# EAGLE design openautopihatv1point2x (EAGLE 8.3.1)
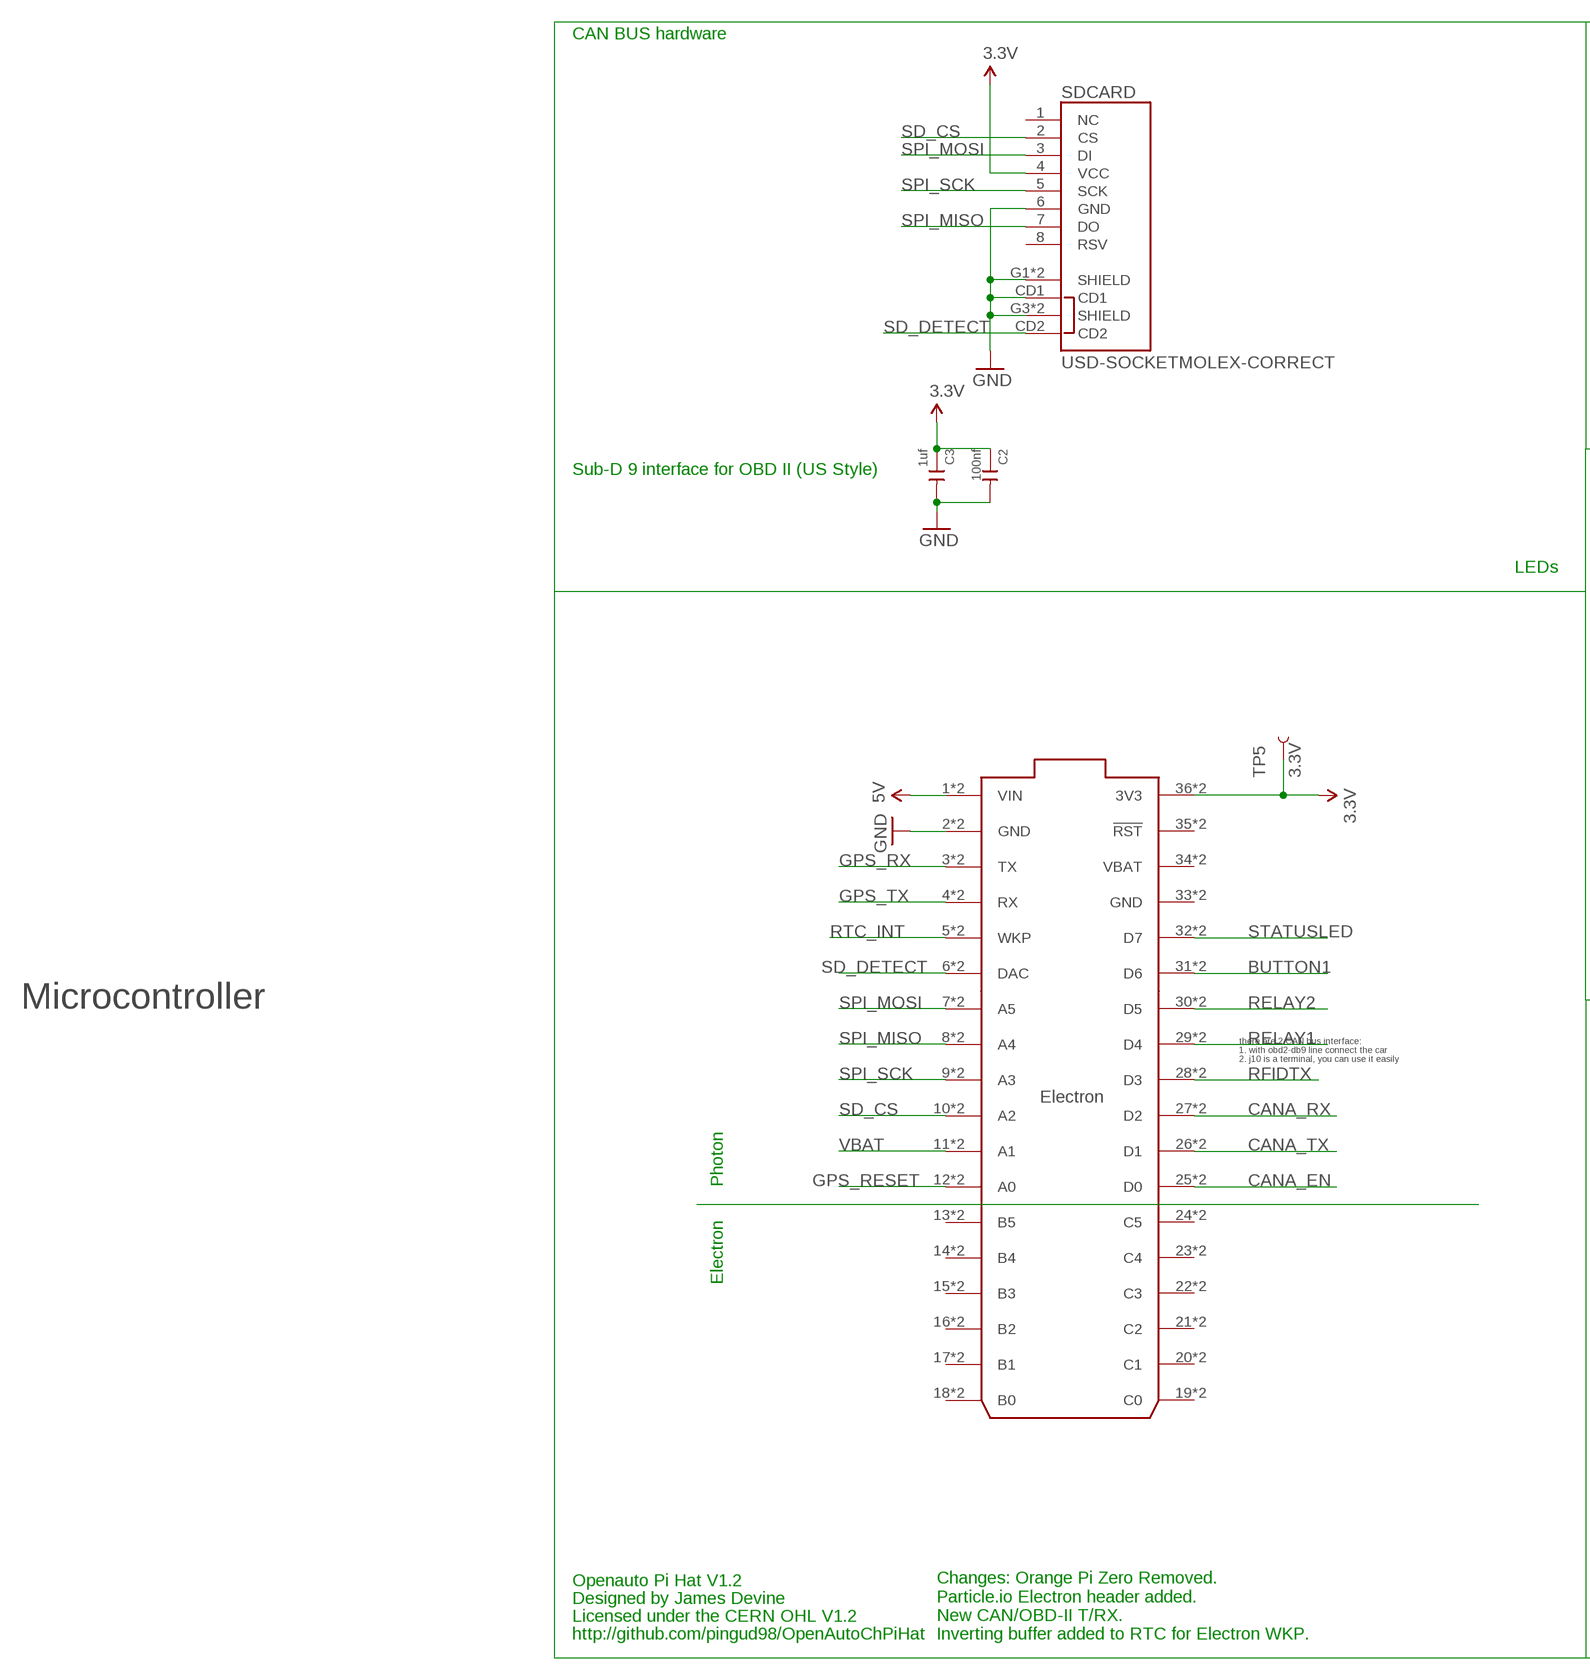
[diagram p0: schematic, sheet 1, part 1 of 2]
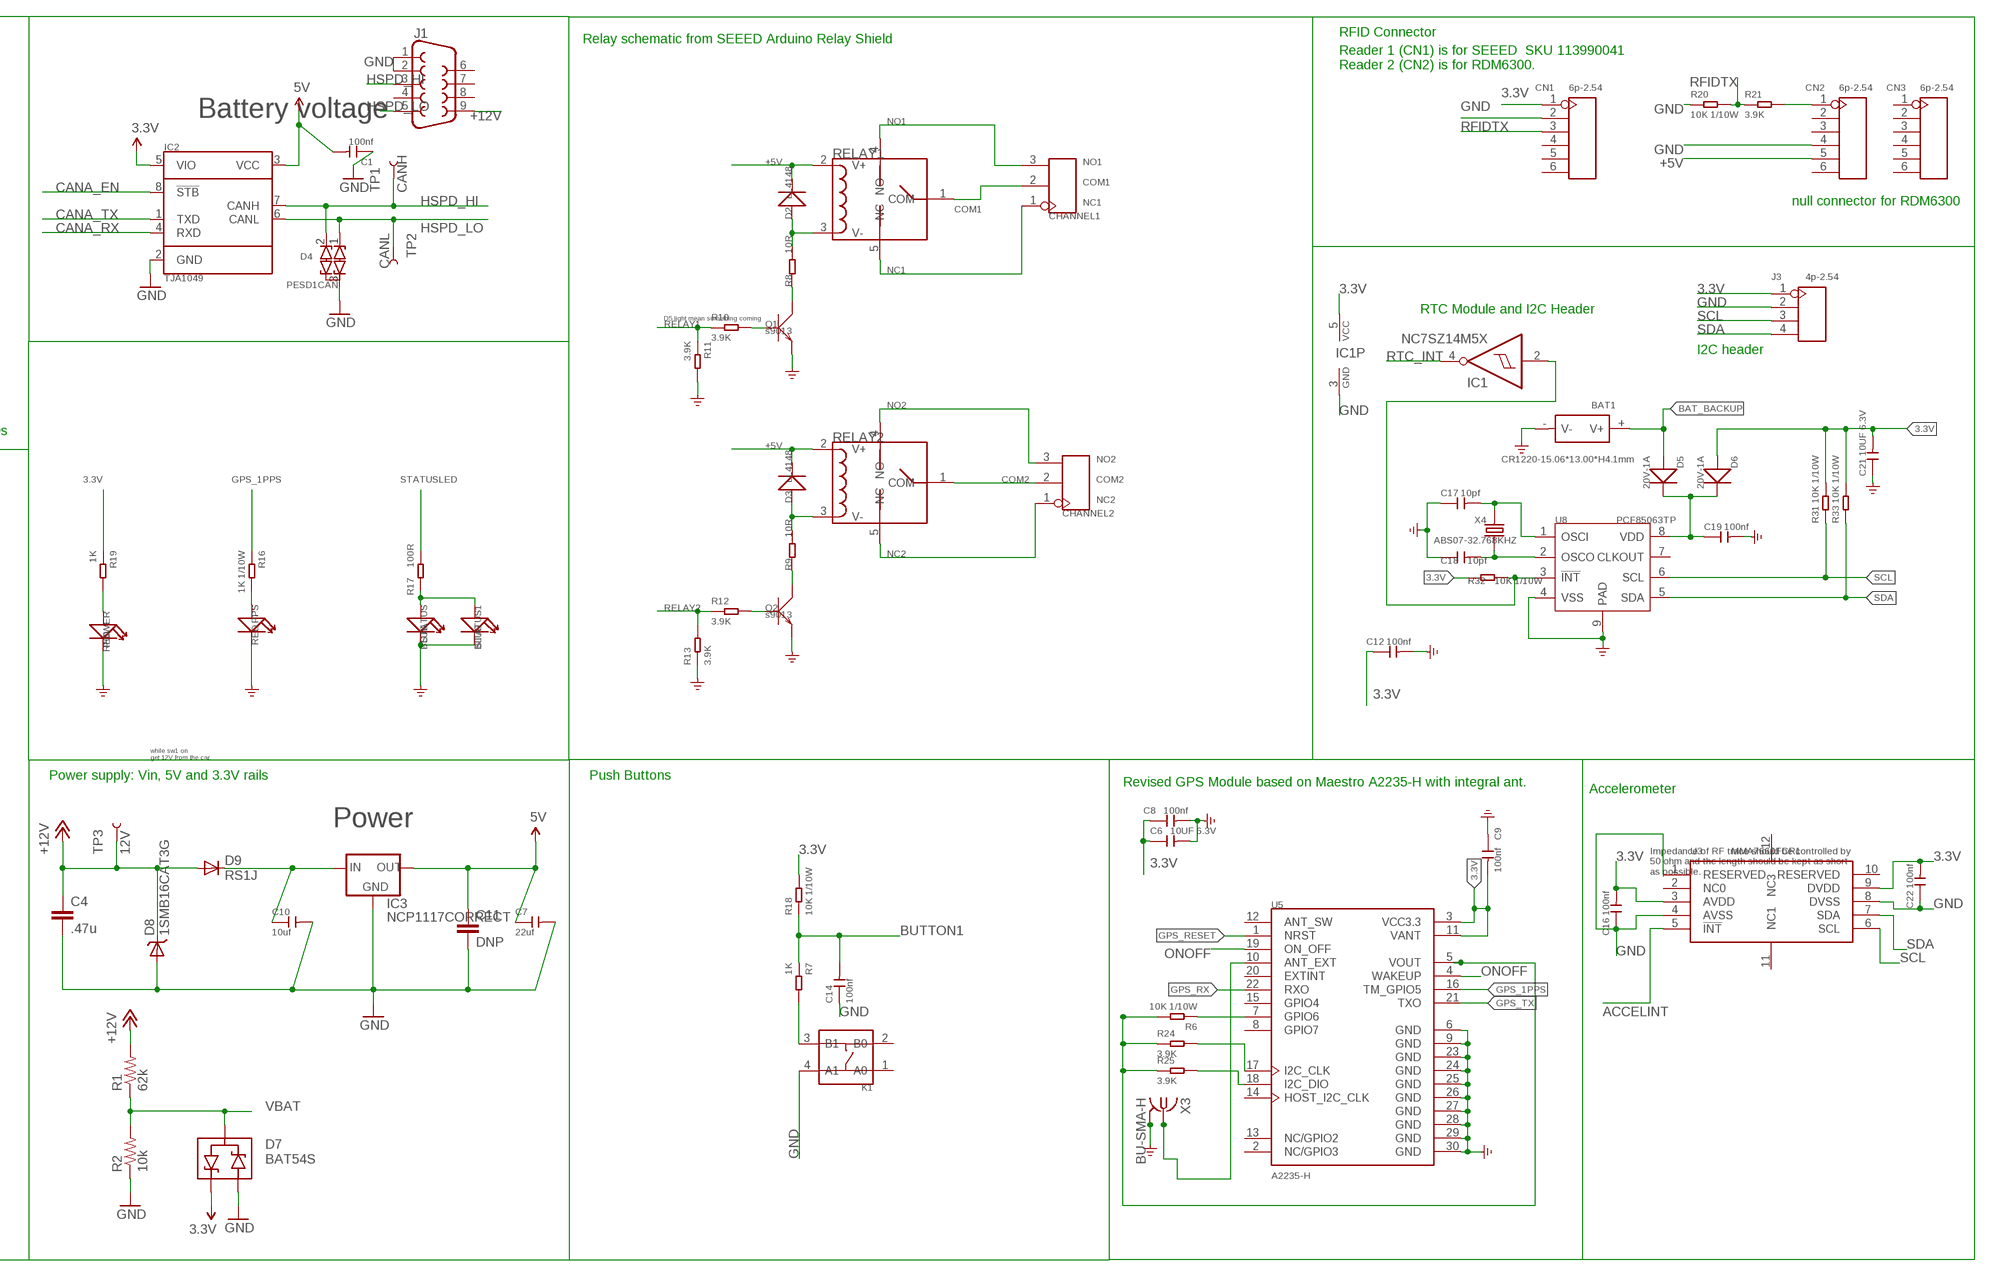
[diagram p1: schematic, sheet 1, part 2 of 2]

## Parts
BAT1  CR1220-15.06*13.00*H4.1mm  BAT-HOLDER'SMD-1220'  [BAT2P-SMD-16.4-CR1220]
C1  100nf  CERAMIC-100NF-50V-10%-X7R(0603)  [C0603]
C2  100nf  CERAMIC-100NF-50V-10%-X7R(0603)  [C0603]
C3  1uf  CERAMIC-1UF-25V-10%-X7R(0603)  [C0603]
C4  .47u  C-EUC0805  [C0805]
C6  10UF 6.3V  CERAMIC-10UF-6.3V-20%-X5R(0603)  [C0603]
C7  22uf  CERAMIC-22UF-6.3V-20%-X5R(0805)  [C0805]
C8  100nf  CERAMIC-100NF-50V-10%-X7R(0603)  [C0603]
C9  100nf  CERAMIC-100NF-50V-10%-X7R(0603)  [C0603]
C10  10uf  CERAMIC-10UF-25V-10%-X5R(0805)  [C0805]
C11  DNP  C-EUC0805  [C0805]
C12  100nf  CERAMIC-100NF-50V-10%-X7R(0603)  [C0603]
C14  100nf  CERAMIC-100NF-50V-10%-X7R(0603)  [C0603]
C16  100nf  CERAMIC-100NF-50V-10%-X7R(0603)  [C0603]
C17  10pf  CERAMIC-10PF-50V-5%-NPO(0603)  [C0603]
C18  10pf  CERAMIC-10PF-50V-5%-NPO(0603)  [C0603]
C19  100nf  CERAMIC-100NF-50V-10%-X7R(0603)  [C0603]
C21  10UF 6.3V  CERAMIC-10UF-6.3V-20%-X5R(0603)  [C0603]
C22  100nf  CERAMIC-100NF-50V-10%-X7R(0603)  [C0603]
CHANNEL1  SCREW-TERMINAL-3P'3.5'  [3P-3.5]
CHANNEL2  SCREW-TERMINAL-3P'3.5'  [3P-3.5]
CN1  6p-2.54  DIP-BLACK-FEMALE-HEADER-VERT(6P-2.54)  [H6-2.54]
CN2  6p-2.54  DIP-BLACK-FEMALE-HEADER-VERT(6P-2.54)  [H6-2.54]
CN3  6p-2.54  DIP-BLACK-FEMALE-HEADER-VERT(6P-2.54)  [H6-2.54]
D2  LL4148  D'1N4148-SMD'  [LL-34]
D3  LL4148  D'1N4148-SMD'  [LL-34]
D4  PESD1CAN  DIODE_ESD_DUAL-SOT-23  [SOT23]
D5  20V-1A  SMD-DIODE-SCHOTTKY-20V-1A(SOD-123)  [SOD-123]
D6  20V-1A  SMD-DIODE-SCHOTTKY-20V-1A(SOD-123)  [SOD-123]
D7  BAT54S  [SOT23]
D8  1SMB16CAT3G  DIODE-TVS-SMB  [SMB-DIODE]
D9  RS1J  DIODESMA  [SMA-DIODE]
ELECTRON  ELECTRON_WITH_EXTERNAL_HEADERS  [ELECTRON_EXTERNAL]
IC1  NC7SZ14M5X  [SOT23-5]
IC2  TJA1049  [SO8]
IC3  NCP1117CORRECT  [SOT223]
J1  DB9MALE  [DB9_MALE]
J3  4p-2.54  DIP-BLACK-FEMALE-HEADER-VERT(4P-2.54)  [H4-2.54]
K1  DIP-SWITCH-TACTILE-SPST-NO/TS-1109(4P-D6.0MM)'TS-1109'  [SW4-6.0X6.0X5.0MM]
POWER  RED  LED'0603'  [LED-0603]
PPS  RED  LED'0603'  [LED-0603]
Q1  s9013  TRANSISTOR-NPN-SOT23  [SOT23]
Q2  s9013  TRANSISTOR-NPN-SOT23  [SOT23]
R1  62k  R-US_R0805  [R0805]
R2  10k  R-US_R0805  [R0805]
R6  10K 1/10W  SMD-RES-10K-5%-1/10W(0603)  [R0603]
R7  1K  SMD-RES-1K-1%-1/10W(0603)  [R0603]
R8  10R  R-0603  [R0603]
R9  10R  R-0603  [R0603]
R10  3.9K  SMD-RES-3.9K-5%-1/10W(0603)  [R0603]
R11  3.9K  SMD-RES-3.9K-5%-1/10W(0603)  [R0603]
R12  3.9K  SMD-RES-3.9K-5%-1/10W(0603)  [R0603]
R13  3.9K  SMD-RES-3.9K-5%-1/10W(0603)  [R0603]
R16  1K 1/10W  SMD-RES-1K-5%-1/10W(0603)  [R0603]
R17  100R  SMD-RES-100R-5%-1/10W(0603)  [R0603]
R18  10K 1/10W  SMD-RES-10K-5%-1/10W(0603)  [R0603]
R19  1K  SMD-RES-1K-1%-1/10W(0603)  [R0603]
R20  10K 1/10W  SMD-RES-10K-5%-1/10W(0603)  [R0603]
R21  3.9K  SMD-RES-3.9K-5%-1/10W(0603)  [R0603]
R24  3.9K  SMD-RES-3.9K-5%-1/10W(0603)  [R0603]
R25  3.9K  SMD-RES-3.9K-5%-1/10W(0603)  [R0603]
R31  10K 1/10W  SMD-RES-10K-5%-1/10W(0603)  [R0603]
R32  10K 1/10W  SMD-RES-10K-5%-1/10W(0603)  [R0603]
R33  10K 1/10W  SMD-RES-10K-5%-1/10W(0603)  [R0603]
RELAY1  RELAY-HLS8L-DC5V-S-C  [5P-19.0X15.5X15.8H]
RELAY2  RELAY-HLS8L-DC5V-S-C  [5P-19.0X15.5X15.8H]
SDCARD  USD-SOCKETMOLEX-CORRECT  [MICRO-SD-MOLEX-CORRECT]
STATUS  BLUE  LED'0603'  [LED-0603]
STATUS1  BLUE  LED'0603'  [LED-0603]
TP1  CANH  TEST-POINT3  [PAD.03X.03]
TP2  CANL  TEST-POINT3  [PAD.03X.03]
TP3  12V  TEST-POINT3  [PAD.03X.03]
TP5  3.3V  TEST-POINT3  [PAD.03X.03]
U3  MMA7660FCR1  MOTION/POSITION-MMA7660FCR1(DFN10)  [DFN10-0.5-3.0X3.0MM]
U5  A2235-H  [XCVR_A2235-H]
U8  PCF85063TP  RTC-PCF85063TP  [HWSON8-0.5-2X3X0.75MM]
X3  BU-SMA-H  [BU-SMA-H]
X4  ABS07-32.768KHZ  CRYSTAL-2P-3215  [X2-SMD-3.2X1.5X0.55MM]

## Nets
3.3V: C2.1 C3.1 C6.1 C8.1 C9.2 C12.1 C16.2 C21.2 C22.2 CN1.1 D6.+ D7.2(C1) ELECTRON.36(3V3) ELECTRON.@36(3V3) IC1.5(VCC) IC2.5(VIO) J3.1 R18.2 R19.1 R31.2 R32.1 R33.2 SDCARD.4(VCC) TP5.P$1 U3.3(AVDD) U3.9(DVDD) U5.3(VCC3.3) U5.11(VANT)
5V [power]: C1.2 C7.1 C11.1 ELECTRON.1(VIN) ELECTRON.@1(VIN) IC2.3(VCC) IC3.2(OUT) IC3.4(OUT)
!RTC_INT: IC1.2(I) R32.2 U8.3(!INT)
+5V [5V Line]: CN2.5 D2.C(-) D3.C(-) RELAY1.2(V+) RELAY2.2(V+)
+12V [power]: C4.1 D8.C D9.A J1.9 R1.2 TP3.P$1
ACCELINT: U3.5(!INT)
BAT_BACKUP: BAT1.+(V+) D5.+
BUTTON1: C14.2 ELECTRON.31(D6) ELECTRON.@31(D6) R7.1 R18.1
CANA_EN: ELECTRON.25(D0) ELECTRON.@25(D0) IC2.8(!STB)
CANA_RX: ELECTRON.27(D2) ELECTRON.@27(D2) IC2.4(RXD)
CANA_TX: ELECTRON.26(D1) ELECTRON.@26(D1) IC2.1(TXD)
COM1: CHANNEL1.2 RELAY1.1(COM)
COM2: CHANNEL2.2 RELAY2.1(COM)
GND [power]: BAT1.-(V-) C1.1 C2.2 C3.2 C4.2 C6.2 C7.2 C8.2 C9.1 C10.2 C11.2 C12.2 C14.1 C16.1 C17.1 C18.1 C19.2 C21.1 C22.1 CN1.2 CN2.4 D4.3(COM) D7.1(A2) D8.A ELECTRON.2(GND) ELECTRON.@2(GND) IC1.3(GND) IC2.2(GND) IC3.1(GND) J1.1 J1.2 J3.2 K1.4(A1) POWER.- PPS.- Q1.2(E) Q2.2(E) R2.1 R11.2 R13.1 R20.1 SDCARD.6(GND) SDCARD.CD1 SDCARD.G1(SHIELD) SDCARD.G2(SHIELD) SDCARD.G3(SHIELD) SDCARD.G4(SHIELD) STATUS1.- STATUS.- U3.1(RESERVED) U3.4(AVSS) U3.8(DVSS) U5.6(GND) U5.9(GND) U5.23(GND) U5.24(GND) U5.25(GND) U5.26(GND) U5.27(GND) U5.28(GND) U5.29(GND) U5.30(GND) U8.4(VSS) U8.9(PAD) X3.2 X3.3 X3.4 X3.5 ; supply symbol labelled GND_POWER
GPS_1PPS: R16.1 U5.16(TM_GPIO5)
GPS_RESET: ELECTRON.12(A0) ELECTRON.@12(A0) U5.1(NRST)
GPS_RX: ELECTRON.3(TX) ELECTRON.@3(TX) U5.22(RXO)
GPS_TX: ELECTRON.4(RX) ELECTRON.@4(RX) U5.21(TXO)
HSPD_HI: D4.2(C2) IC2.7(CANH) J1.3 TP1.P$1
HSPD_LO: D4.1(C1) IC2.6(CANL) J1.5 TP2.P$1
N$1: K1.3(B1) R7.2
N$4 [5V Line]: Q2.1(B) R12.2
N$5 [5V Line]: D3.A(+) R9.2 RELAY2.3(V-)
N$6 [5V Line]: Q1.3(C) R8.1
N$7 [5V Line]: D2.A(+) R8.2 RELAY1.3(V-)
N$8 [5V Line]: Q2.3(C) R9.1
N$9: PPS.+ R16.2
N$10: R17.2 STATUS1.+ STATUS.+
N$19: U5.10(ANT_EXT) X3.1
N$21: R6.2 R24.1 R25.1 U5.5(VOUT)
N$22: R6.1 U5.7(GPIO6)
N$23 [5V Line]: Q1.1(B) R10.2
N$24: CN2.1 R21.2
N$26: R24.2 U5.17(I2C_CLK)
N$27: R25.2 U5.18(I2C_DIO)
N$29: POWER.+ R19.2
N$40: C18.2 U8.2(OSCO) X4.1
N$41: C17.2 U8.1(OSCI) X4.2
N$43 [power]: C10.1 D9.C IC3.3(IN)
N$49: C19.1 D5.- D6.- U8.8(VDD)
NC1: CHANNEL1.1 RELAY1.5(NC)
NC2: CHANNEL2.1 RELAY2.5(NC)
NO1: CHANNEL1.3 RELAY1.4(NO)
NO2: CHANNEL2.3 RELAY2.4(NO)
ONOFF: U5.4(WAKEUP) U5.19(ON_OFF)
RELAY1 [5V Line]: ELECTRON.29(D4) ELECTRON.@29(D4) R10.1 R11.1
RELAY2: ELECTRON.30(D5) ELECTRON.@30(D5) R12.1 R13.2
RFIDTX: CN1.3 ELECTRON.28(D3) ELECTRON.@28(D3) R20.2 R21.1
RTC_INT: ELECTRON.5(WKP) ELECTRON.@5(WKP) IC1.4(O)
SCL: J3.3 R31.1 U3.6(SCL) U8.6(SCL)
SD_CS: ELECTRON.10(A2) ELECTRON.@10(A2) SDCARD.2(CS)
SD_DETECT: ELECTRON.6(DAC) ELECTRON.@6(DAC) SDCARD.CD2
SDA: J3.4 R33.1 U3.7(SDA) U8.5(SDA)
SPI_MISO: ELECTRON.8(A4) ELECTRON.@8(A4) SDCARD.7(DO)
SPI_MOSI: ELECTRON.7(A5) ELECTRON.@7(A5) SDCARD.3(DI)
SPI_SCK: ELECTRON.9(A3) ELECTRON.@9(A3) SDCARD.5(SCK)
STATUSLED: ELECTRON.32(D7) ELECTRON.@32(D7) R17.1
VBAT: D7.3(COM) ELECTRON.11(A1) ELECTRON.@11(A1) R1.1 R2.2
Unconnected: CN1.4 CN1.5 CN1.6 CN2.2 CN2.3 CN2.6 CN3.1 CN3.2 CN3.3 CN3.4 CN3.5 CN3.6 ELECTRON.13(B5) ELECTRON.14(B4) ELECTRON.15(B3) ELECTRON.16(B2) ELECTRON.17(B1) ELECTRON.18(B0) ELECTRON.19(C0) ELECTRON.20(C1) ELECTRON.21(C2) ELECTRON.22(C3) ELECTRON.23(C4) ELECTRON.24(C5) ELECTRON.35(!RST) ELECTRON.@13(B5) ELECTRON.@14(B4) ELECTRON.@15(B3) ELECTRON.@16(B2) ELECTRON.@17(B1) ELECTRON.@18(B0) ELECTRON.@19(C0) ELECTRON.@20(C1) ELECTRON.@21(C2) ELECTRON.@22(C3) ELECTRON.@23(C4) ELECTRON.@24(C5) ELECTRON.@35(!RST) J1.4 J1.6 J1.7 J1.8 K1.1(A0) K1.2(B0) SDCARD.1(NC) SDCARD.8(RSV) U3.2(NC0) U3.10(RESERVED) U3.11(NC1) U3.12(NC3) U5.2(NC/GPIO3) U5.8(GPIO7) U5.12(ANT_SW) U5.13(NC/GPIO2) U5.14(HOST_I2C_CLK) U5.15(GPIO4) U5.20(EXTINT) U8.7(CLKOUT)

## Notes on the sheet
- CAN BUS hardware
- RFID Connector
- Relay schematic from SEEED Arduino Relay Shield
- Reader 1 (CN1) is for SEEED  SKU 113990041
  Reader 2 (CN2) is for RDM6300.
- Battery voltage
- null connector for RDM6300
- RTC Module and I2C Header
- D5 light mean something coming
- I2C header
- Sub-D 9 interface for OBD II (US Style)
- LEDs
- while sw1 on
- get 12V from the car,
- Microcontroller
- Power supply: Vin, 5V and 3.3V rails | Push Buttons
- Revised GPS Module based on Maestro A2235-H with integral ant.
- there are 2 CAN bus interface: | Accelerometer
- 1. with obd2-db9 line connect the car
- 2. j10 is a terminal, you can use it easily
- Power
- Impedance of RF trace should be controlled by 
  50 ohm and the length should be kept as short 
  as possible.
- Photon
- Electron
- short route
- Openauto Pi Hat V1.2
- Designed by James Devine
- Licensed under the CERN OHL V1.2
- http://github.com/pingud98/OpenAutoChPiHat
- Changes: Orange Pi Zero Removed.
  Particle.io Electron header added.
  New CAN/OBD-II T/RX.
  Inverting buffer added to RTC for Electron WKP.

## Power pins joined to a net without a drawn wire
GND: ELECTRON.33(GND) ELECTRON.@33(GND)
VBAT: ELECTRON.34(VBAT) ELECTRON.@34(VBAT)

## Library data of the parts
BAT1 = Connector-new:BAT-HOLDER: BAT2P-13.5-CR1220:320170002;BAT2P-SMD-20.5-CR1632:320170007;METAL-CR2032-D20.0*H6.3MM:320170003;METAL-CR2032-SMD:320170006;PLASTIC-CR1220-L15.06*W13.0*H4.1MM:320170000;PLASTIC-CR2032-L25.2*W15.6*H5.2MM:320170005;BAT2P-11.55-D12.55-CR1220:313010022
C1 C2 = Seeed-Capacitor:CERAMIC-100NF-50V-10%-X7R(0603): 302010138; MPN: CC0603KRX7R9BB104; PARTNO: 08055C104KAT2A
C3 = Seeed-Capacitor:CERAMIC-1UF-25V-10%-X7R(0603): 302010139; MPN: CC0603KRX7R8BB105; PARTNO: CC0805KKX7R7BB105
C4 = rcl:C-EU: CAPACITOR, European symbol; PARTNO: C0805C474K5RACTU
C6 C21 = Seeed-Capacitor:CERAMIC-10UF-6.3V-20%-X5R(0603): 302010286; MPN: CC0603MRX5R5BB106
C7 = Seeed-Capacitor:CERAMIC-22UF-6.3V-20%-X5R(0805): 302010171; MPN: CC0805MKX5R5BB226; PARTNO: GRM219R61A226MEA0D
C8 C9 C12 C14 C16 C19 C22 = Seeed-Capacitor:CERAMIC-100NF-50V-10%-X7R(0603): 302010138; MPN: CC0603KRX7R9BB104
C10 = Seeed-Capacitor:CERAMIC-10UF-25V-10%-X5R(0805): 302010178; MPN: CC0805KKX5R8BB106; PARTNO: GRM21BR6YA106KE43L
C11 = rcl:C-EU: CAPACITOR, European symbol; PARTNO: GRM219R61A226MEA0D
C17 C18 = Seeed-Capacitor:CERAMIC-10PF-50V-5%-NPO(0603): 302010097; MPN: CC0603JRNPO9BN100
CHANNEL1 CHANNEL2 = Connector :SCREW-TERMINAL-3P
CN1-CN3 = Seeed-Connector:DIP-BLACK-FEMALE-HEADER-VERT(6P-2.54): 320030060; MPN: F185-1106A1BSYC1
D2 D3 = discrete:D*
D4 = MuniRent:DIODE_ESD_DUAL: Dual ESD Diode, with a common anode; PARTNO: PESD1CAN-215
D5 D6 = Seeed-Diode:SMD-DIODE-SCHOTTKY-20V-1A(SOD-123): 304020034; MPN: B5819W
D7 = MuniRent:BAT54S; PARTNO: BAT54S-7-F
D8 = BUG:DIODE-TVS; PARTNO: 1SMB16CAT3G; ROLE: Overvoltage protection
D9 = BUG:DIODE: Diode These are standard reverse protection diodes and small signal diodes. SMA package can handle up to about 1A. SOD-323 can handle about 200mA. What the SOD-323 package when ordering, there are some mfgs out there that are 5-pin packages.; PARTNO: RS1J-E3/5AT; ROLE: Reverse protection
ELECTRON = MuniRent:ELECTRON; PARTNO: PPTC181LFBN-RC
IC1 = 74xx-little-us:NC7SZ14: TinyLogic(R) UHS Inverter with Schmitt Trigger Input Source: http://www.fairchildsemi.com/ds/NC/NC7SZ14.pdf
IC2 = MuniRent:TJA1049; PARTNO: TJA1049T-118
IC3 = MuniRent:NCP1117; PARTNO: NCP1117LPST50T3G
J1 = SparkFun-Connectors:DB9: DB9 Connector Standard DB9 (D-Sub 9) serial connector. Can be used for CAN bus as well as RS485 and RS232. Footprint production proven. Here is the female version connector we sell at SparkFun: 9 Pin Female Serial Connector - PCB Mount <https://www.sparkfun.com/products/429> (PRT-00429) This connector has been used on the following SparkFun products: SparkFun RS232 Shifter - SMD <https://www.sparkfun.com/products/449> (PRT-00449) SparkFun RS232 Shifter SMD (No DB9) <https://www.sparkfun.com/products/8780> (PRT-08780); PROD_ID: CONN-09904
J3 = Seeed-Connector:DIP-BLACK-FEMALE-HEADER-VERT(4P-2.54): 320030017; MPN: F185-1104A1BSYA1
K1 = Seeed-Switch:DIP-SWITCH-TACTILE-SPST-NO/TS-1109(4P-D6.0MM): 311020024
POWER PPS STATUS STATUS1 = Discrete:LED*
Q1 Q2 = discrete:TRANSISTOR-NPN*: NPN audion
R1 = rcl:R-US_: RESISTOR, American symbol; PARTNO: ERJ-6ENF6202V
R2 = rcl:R-US_: RESISTOR, American symbol; PARTNO: ERJ-6ENF1002V
R6 R18 R20 R31-R33 = Seeed-Resistor:SMD-RES-10K-5%-1/10W(0603): 301010293; MPN: RC0603JR-0710KL
R7 R19 = Seeed-Resistor:SMD-RES-1K-1%-1/10W(0603): 301010298; MPN: RC0603FR-071KL
R8 R9 = discrete:R*
R10-R13 R21 R24 R25 = Seeed-Resistor:SMD-RES-3.9K-5%-1/10W(0603): 301010101; MPN: RC0603JR-073K9L
R16 = Seeed-Resistor:SMD-RES-1K-5%-1/10W(0603): 301010291; MPN: RC0603JR-071KL
R17 = Seeed-Resistor:SMD-RES-100R-5%-1/10W(0603): 301010090; MPN: RC0603JR-07100RL
RELAY1 RELAY2 = discrete:RELAY-HLS8L-DC5V-S-C
SDCARD = MuniRent:USD-SOCKET: microSD Socket Push-push type uSD socket. Schematic element and footprint production proven. Spark Fun Electronics SKU : PRT-00127. tDoc lines correctly indicate media card edge positions when inserting (unlocked, locked, depressed). NOTE: CD1 and CD2 are connected internally; PARTNO: 1040310811
TP1-TP3 TP5 = SparkFun-Passives:TEST-POINT: Bare copper test points for troubleshooting or ICT; BOM: EXCLUDE
U3 = Seeed-Sensor:MOTION/POSITION-MMA7660FCR1(DFN10): 314080009; MPN: MMA7660FCR1
U5 = A2235-H:A2235-H: Gps Module, Mini Outline w/ Ant; AVAILABILITY: Good; DESCRIPTION: Gps Module, Mini Outline w/ Ant; MF: Maestro Wireless; MP: A2235H; PACKAGE: None; PRICE: 15.93 USD
U8 = IC-new:RTC-PCF85063TP
X3 = con-coax:BU-SMA-H: FEMALE SMA CONNECTOR Radiall; OC_FARNELL: unknown; OC_NEWARK: unknown
X4 = Discrete-new:CRYSTAL-2P

## Net classes
0 default: width 0.152 mm, clearance 0.152 mm
1 power: width 0.152 mm, clearance 0.152 mm
2 5V Line: width 0.152 mm, drill 0.152 mm, clearance 0.152 mm

## Board
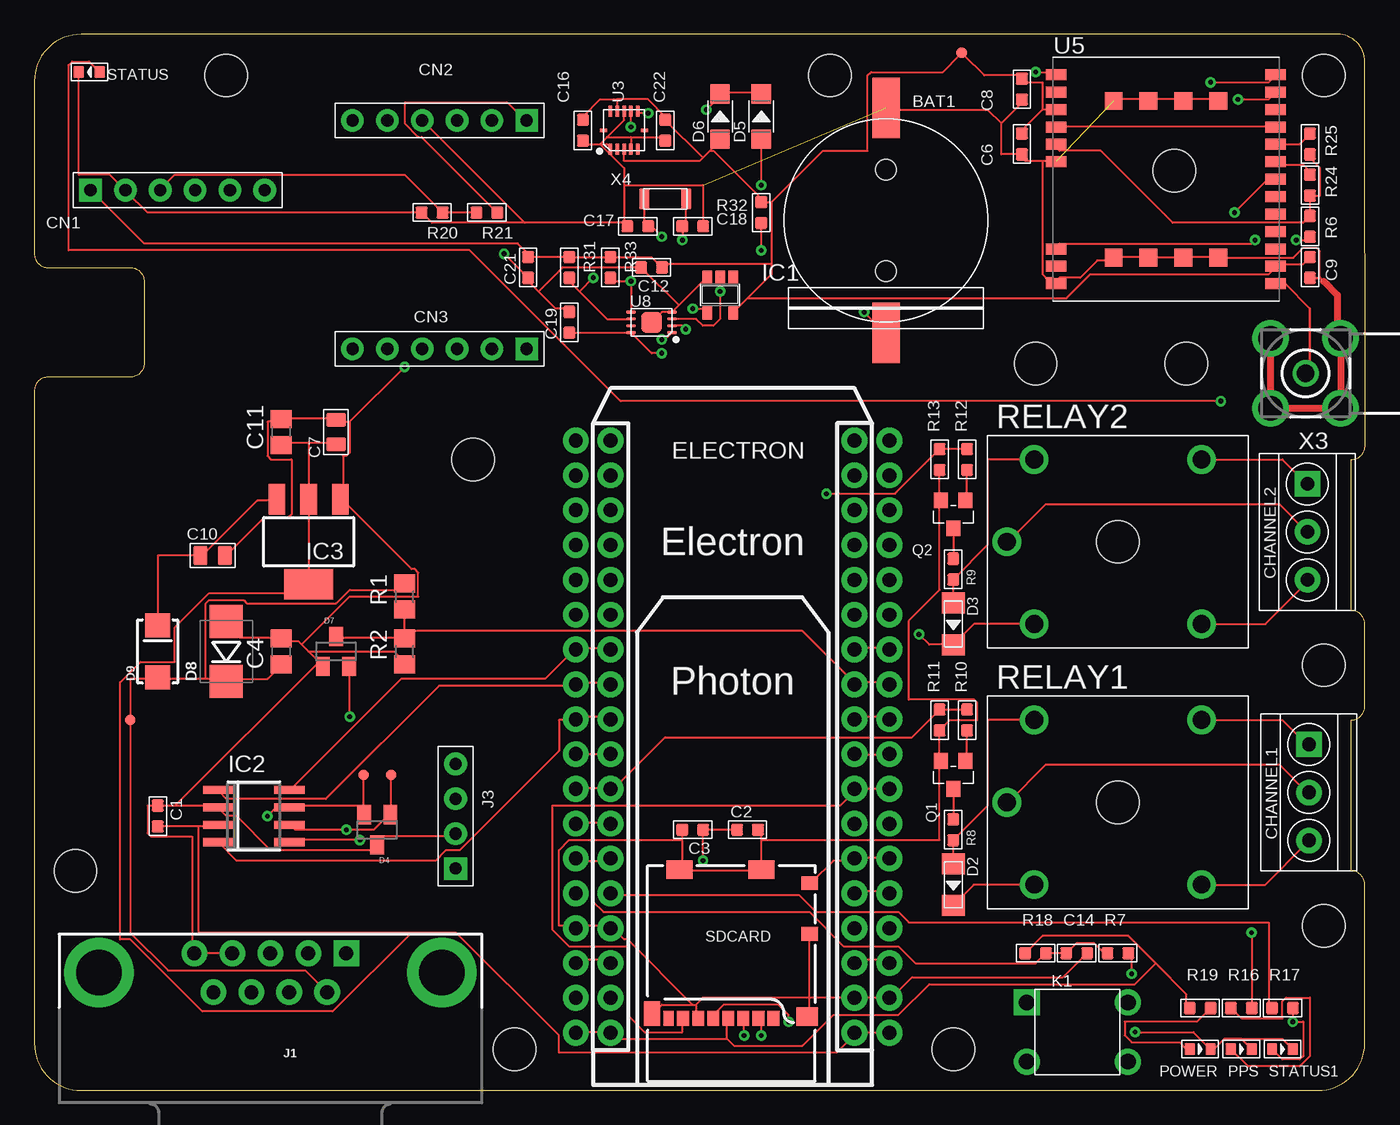
[diagram p2: board, top side]
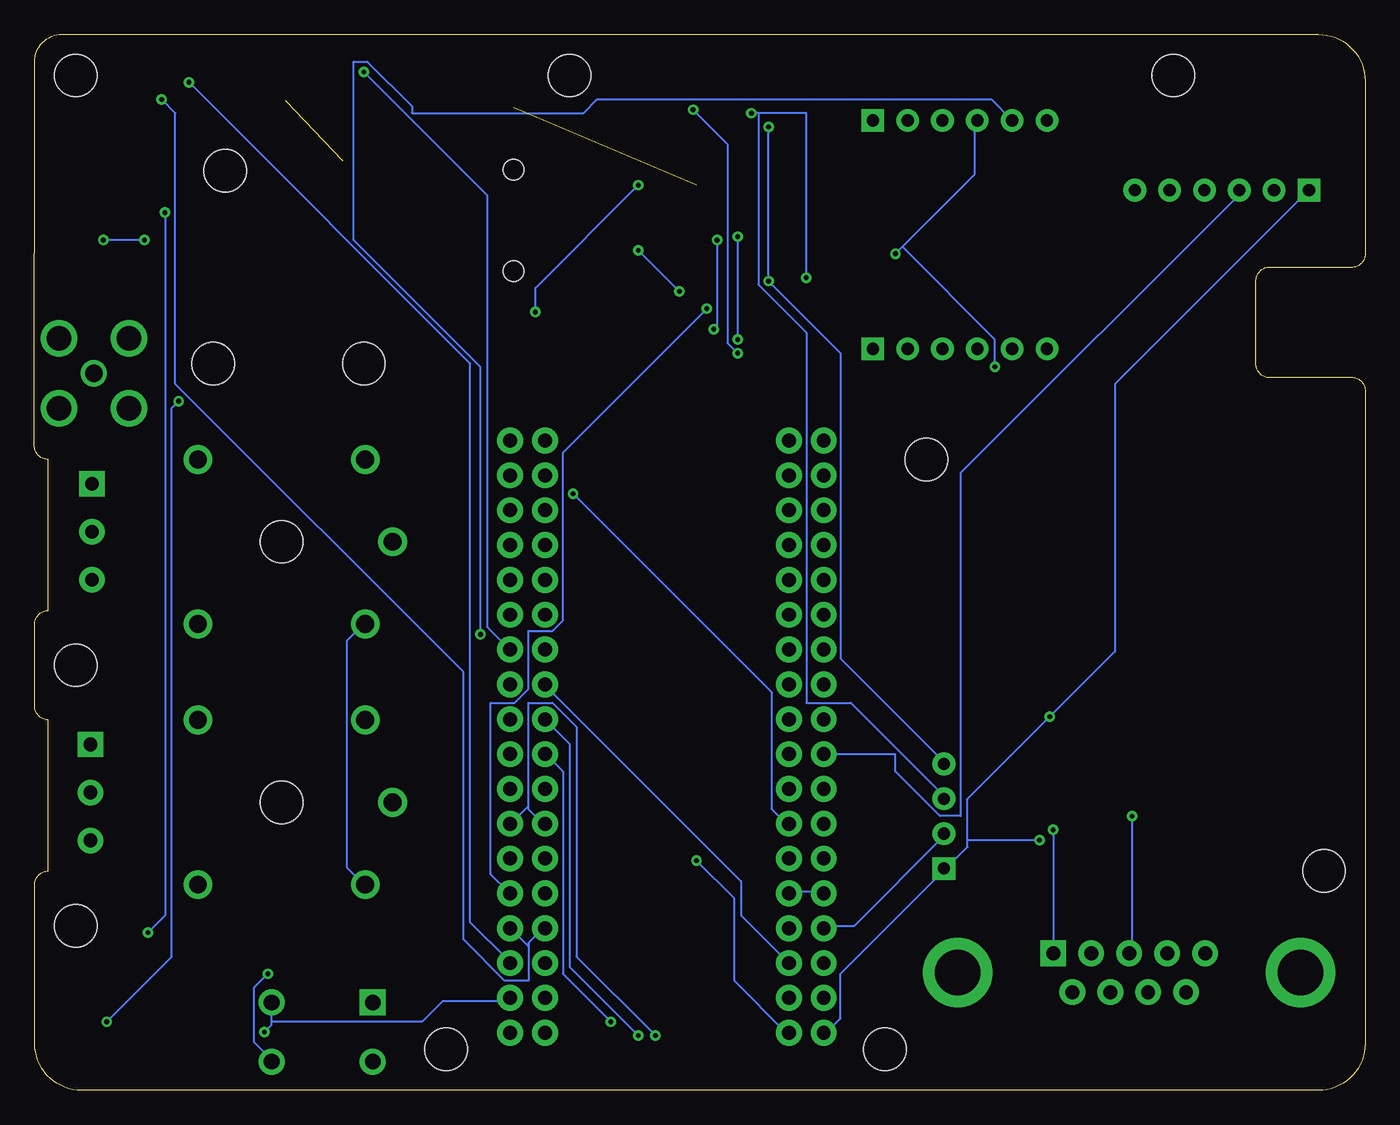
[diagram p3: board, bottom side, seen from below]

Size 97.03 x 77 mm. Coordinates in mm from the lower left corner, seen from the top.
Outline: 7,52 1,52 arc90 0,51 0,3.41 arc90 3.41,0 93.59,0 arc90 97,3.41 97,15 arc90 96,16 96,27 arc90 97,28 97,34 arc90 96,35 96,46 arc90 97.03,47.03 97,75 arc90 95,77 3.41,77 arc90 0,73.59 0,61 arc90 1,60 7,60 arc-90 8,59 8,53 arc-90 7,52
Copper layers (1*16): Top 0.035mm / dielectric 1.5mm / Bottom 0.035mm
Design rules "default": minimum track width 6mil, minimum drill 0.35mm, track to track 6mil, track to pad 6mil, pad to pad 6mil, via to via 6mil, smd to smd 6mil, copper to edge 40mil, drill to drill 6mil, minimum pad ring 10mil, minimum via ring 8mil, stop-mask expansion 4mil, vias tented up to drill 0mil, thermal gap 10mil
Holes 3.1 mm at 14,74 3,16 32,46 94,12 67,3 94,31 94,74 58,74 84,53 73,53 79,21 79,40 35,3
tKeepout: area 44,21 to 58,51
bKeepout: area 44,21 to 58,51

### Footprints (pad centres in the part's own frame; a part is rotated, then mirrored left to right if it is on the bottom)
BAT2P-SMD-16.4-CR1220 = smd 2 x 4.4: + 0,-8.2; - 0,8.2 | hole 1.5: 0,3.7; 0,-3.7
C0603 = smd 0.889 x 0.889: 1 0,0.762; 2 0,-0.762
C0805 = smd 1.3 x 1.5: 1 -0.95,0; 2 0.95,0
C0805' = smd 1.397 x 1.016: 1 0,0.889; 2 0,-0.889
3P-3.5 = drill 1 pad 1.85 square: 1 0,-3.5 | drill 1 pad 1.85: 2 0,0; 3 0,3.5
H6-2.54 = drill 0.889 pad 1.651 square: 1 0,6.35 | drill 0.889 pad 1.651: 2 0,3.81; 3 0,1.27; 4 0,-1.27; 5 0,-3.81; 6 0,-6.35
LL-34 = smd 1.524 x 1.676: A -1.524,0; C 1.524,0
SOT23 = smd 1 x 1.4: 1 -0.95,-1.1; 2 0.95,-1.1; 3 0,1.1
SOD-123 = smd 1.397 x 1.397: + -1.651,0; - 1.651,0
SMB-DIODE = smd 2.4 x 2.4: A 2.2,0; C -2.2,0
SMA-DIODE = smd 1.75 x 1.8: A -1.91,0; C 1.91,0
ELECTRON_EXTERNAL = drill 1.016 pad 1.88: 1 1.27,46.99; 2 1.27,44.45; 3 1.27,41.91; 4 1.27,39.37; 5 1.27,36.83; 6 1.27,34.29; 7 1.27,31.75; 8 1.27,29.21; 9 1.27,26.67; 10 1.27,24.13; 11 1.27,21.59; 12 1.27,19.05; 13 1.27,16.51; 14 1.27,13.97; 15 1.27,11.43; 16 1.27,8.89; 17 1.27,6.35; 18 1.27,3.81; 19 19.05,3.81; 20 19.05,6.35; 21 19.05,8.89; 22 19.05,11.43; 23 19.05,13.97; 24 19.05,16.51; 25 19.05,19.05; 26 19.05,21.59; 27 19.05,24.13; 28 19.05,26.67; 29 19.05,29.21; 30 19.05,31.75; 31 19.05,34.29; 32 19.05,36.83; 33 19.05,39.37; 34 19.05,41.91; 35 19.05,44.45; 36 19.05,46.99; @1 -1.27,46.99; @2 -1.27,44.45; @3 -1.27,41.91; @4 -1.27,39.37; @5 -1.27,36.83; @6 -1.27,34.29; @7 -1.27,31.75; @8 -1.27,29.21; @9 -1.27,26.67; @10 -1.27,24.13; @11 -1.27,21.59; @12 -1.27,19.05; @13 -1.27,16.51; @14 -1.27,13.97; @15 -1.27,11.43; @16 -1.27,8.89; @17 -1.27,6.35; @18 -1.27,3.81; @19 21.59,3.81; @20 21.59,6.35; @21 21.59,8.89; @22 21.59,11.43; @23 21.59,13.97; @24 21.59,16.51; @25 21.59,19.05; @26 21.59,21.59; @27 21.59,24.13; @28 21.59,26.67; @29 21.59,29.21; @30 21.59,31.75; @31 21.59,34.29; @32 21.59,36.83; @33 21.59,39.37; @34 21.59,41.91; @35 21.59,44.45; @36 21.59,46.99
SOT23-5 = smd 0.69 x 0.99: 1 -0.95,-1.29; 2 0,-1.29; 3 0.95,-1.29; 4 0.95,1.3; 5 -0.95,1.3
SO8 = smd 0.6 x 2.2: 1 -1.905,-2.6; 2 -0.635,-2.6; 3 0.635,-2.6; 4 1.905,-2.6; 5 1.905,2.6; 6 0.635,2.6; 7 -0.635,2.6; 8 -1.905,2.6
SOT223 = smd 1.219 x 2.235: 1 -2.311,-3.099; 2 0,-3.099; 3 2.311,-3.099 | smd 3.6 x 2.2: 4 0,3.099
DB9_MALE = drill 1.016 pad 1.88: 1 5.54,-1.42; 2 2.77,-1.42; 3 0,-1.42; 4 -2.77,-1.42; 6 4.15,1.42; 7 1.38,1.42; 8 -1.38,1.42; 9 -4.15,1.42 | drill 1.016 pad 1.88 square: 5 -5.54,-1.42 | drill 3.302 pad 5.08: G1 -12.5,0; G2 12.5,0
H4-2.54 = drill 0.889 pad 1.651 square: 1 0,3.81 | drill 0.889 pad 1.651: 2 0,1.27; 3 0,-1.27; 4 0,-3.81
SW4-6.0X6.0X5.0MM = drill 1.143 pad 1.905 square: 1 -3.683,2.159 | drill 1.143 pad 1.905: 2 -3.683,-2.159; 3 3.683,-2.159; 4 3.683,2.159
LED-0603 = smd 0.762 x 0.889: + -0.762,0; - 0.762,0
SOT23' = smd 1.016 x 1.143: 1 -0.889,-1.016; 2 0.889,-1.016; 3 0,1.016
R0805 = smd 1.3 x 1.5: 1 -0.95,0; 2 0.95,0
R0603 = smd 0.889 x 0.889: 1 0,0.762; 2 0,-0.762
R0603' = smd 0.889 x 0.889: 1 -0.762,0; 2 0.762,0
5P-19.0X15.5X15.8H = drill 1.3 pad 2.1: 1 -8.1,0; 2 -6.1,-6; 3 -6.1,6; 4 6.1,-6; 5 6.1,6
MICRO-SD-MOLEX-CORRECT = smd 0.85 x 1.1: 1 3.105,0.25; 2 2.005,0.25; 3 0.905,0.25; 4 -0.195,0.25; 5 -1.295,0.25; 6 -2.395,0.25; 7 -3.495,0.25 | smd 0.75 x 1.1: 8 -4.545,0.25 | smd 1.2 x 1: CD1 5.74,6.4; CD2 5.74,10.1 | smd 1.55 x 1.35: G1 5.565,0.375 | smd 1.17 x 1.8: G2 -5.755,0.6 | smd 1.9 x 1.35: G3 -3.735,11.075; G4 2.235,11.075
PAD.03X.03 = smd 0.762 x 0.762: P$1 0,0
DFN10-0.5-3.0X3.0MM = smd 0.8 x 0.25: 1 -1.375,1; 2 -1.375,0.5; 3 -1.375,0; 4 -1.375,-0.5; 5 -1.375,-1; 6 1.375,-1; 7 1.375,-0.5; 8 1.375,0; 9 1.375,0.5; 10 1.375,1 | smd 0.25 x 0.5: 11 0,-1.5; 12 0,1.5
XCVR_A2235-H = smd 1.5 x 0.8: 1 -8,7.62; 2 -8,6.35; 3 -8,5.08; 4 -8,3.81; 5 -8,2.54; 6 -8,1.27; 7 -8,-5.08; 8 -8,-6.35; 9 -8,-7.62; 10 8,-7.62; 11 8,-6.35; 12 8,-5.08; 13 8,-3.81; 14 8,-2.54; 15 8,-1.27; 16 8,0; 17 8,1.27; 18 8,2.54; 19 8,3.81; 20 8,5.08; 21 8,6.35; 22 8,7.62 | smd 1.3 x 1.3: 23 -3.81,5.715; 24 -1.27,5.715; 25 1.27,5.715; 26 3.81,5.715; 27 -3.81,-5.715; 28 -1.27,-5.715; 29 1.27,-5.715; 30 3.81,-5.715 | hole 3.1: 0.605,0.63
HWSON8-0.5-2X3X0.75MM = smd 0.25 x 0.7: 1 -0.75,-1.5; 2 -0.25,-1.5; 3 0.25,-1.5; 4 0.75,-1.5; 5 0.75,1.5; 6 0.25,1.5; 7 -0.25,1.5; 8 -0.75,1.5 | smd 1.5 x 1.5: 9 0,0
BU-SMA-H = drill 1.27: 1 0,0 | drill 1.778: 2 -2.55,2.55; 3 2.55,2.55; 4 2.55,-2.55; 5 -2.55,-2.55
X2-SMD-3.2X1.5X0.55MM = smd 0.762 x 1.524: 1 -1.524,0; 2 1.524,0

### Placement (x,y rotation side)
BAT1  62.1,63.43 0 top
C1  9,20 0 top
C2  52,19 90 top
C3  48,19 270 top
C4  18,32 90 top
C6  72,69 0 top
C7  22uf  [C0805']  22,48 180 top
C8  72,73 0 top
C9  93,60 180 top
C10  10uf  [C0805']  13,39 90 top
C11  18,48 90 top
C12  45,60 270 top
C14  76,10 270 top
C16  40,70 180 top
C17  44,63 90 top
C18  48,63 270 top
C19  39,56 180 top
C21  36,60 180 top
C22  46,70 180 top
CHANNEL1  92.93,21.72 180 top
CHANNEL2  92.82,40.72 180 top
CN1  10.45,65.63 90 top
CN2  29.55,70.72 270 top
CN3  29.55,54.07 270 top
D2  67,15 270 top
D3  67,34 270 top
D4  25,19 180 top
D5  53,71 90 top
D6  50,71 90 top
D7  22,32 0 top
D8  14,32 90 top
D9  9,32 90 top
ELECTRON  61.07,51.19 180 top
IC1  50,58 180 top
IC2  16,20 270 top
IC3  20,40 180 top
J1  17.21,8.58 180 top
J3  30.71,19.99 180 top
K1  76.04,4.25 0 top
POWER  85,3 0 top
PPS  88,3 0 top
Q1  s9013  [SOT23']  67,23 180 top
Q2  s9013  [SOT23']  67,42 180 top
R1  27,36 90 top
R2  27,32 90 top
R6  93,63 180 top
R7  79,10 90 top
R8  10R  [R0603']  67,19 270 top
R9  10R  [R0603']  67,38 270 top
R10  68,27 0 top
R11  66,27 0 top
R12  68,46 0 top
R13  66,46 180 top
R16  88,6 270 top
R17  91,6 90 top
R18  73,10 270 top
R19  85,6 90 top
R20  29,64 90 top
R21  33,64 90 top
R24  93,66 180 top
R25  93,69 180 top
R31  39,60 180 top
R32  53,64 0 top
R33  42,60 180 top
RELAY1  79,21 0 top
RELAY2  79,40 0 top
SDCARD  50.79,5.01 0 top
STATUS  4.01,74.24 180 top
STATUS1  91,3 0 top
TP1  24,23 0 top
TP2  26,23 0 top
TP3  7,27 0 top
TP5  67.61,75.65 0 top
U3  43,70 90 top
U5  82.5,66.43 0 top
U8  45,56 90 top
X3  92.69,52.28 0 top
X4  46,65 180 top

### Tracks (layer width: path | path; a pad name or v marks a point on that pad's centre or on a via)
3.3V  (via drill 0.35)
  Top 0.152: v23,27.25 23,30.75 D7.2 | v23.75,18.25 18.75,18.25 IC2.5 | 81.75,9.25 84,7 84,6 R19.1 | 81.75,9.25 79.75,11.25 73.5,11.25 R18.2 | C2.1 C3.1 v48.75,16.75 | 50.5,3.75 50.5,5.25 SDCARD.4 | 50.5,3.75 42.5,3.75 42.25,4 ELECTRON.36 42,4.25 39.5,4.25 ELECTRON.@36 | 81.75,9.25 80.25,7.75 65.25,7.75 63,5.5 58.25,5.5 56,3.25 51,3.25 50.5,3.75 | R31.2 C21.2 36,61 35.25,61.75 8,61.75 4.25,65.5 CN1.1 | R31.2 R33.2 | R31.2 | R33.2 45,60.75 C12.1 46,60 46.25,60.25 53.75,60.25 | R33.2 | 73.5,71.5 72,70 C6.1 | 73.5,71.5 U5.3 | 73.5,71.5 73.5,73.5 72.25,73.5 C8.1 72,74 69.25,74 67.75,75.5 TP5.P$1 67.5,75.5 66.25,74.25 61,74.25 60.75,74 60.75,68.5 57.5,68.5 53.75,64.75 | C9.2 92.5,60.25 90.5,60.25 U5.11 90.5,60 90,59.5 77,59.5 75.25,57.75 52,57.75 | 42.5,72.25 U3.9 | 42.5,72.25 41.25,72.25 40,71 C16.2 | U3.3 43,67.75 48.5,67.75 48.75,68 | 49.25,68.5 50,69.25 D6.+ | 49.25,68.5 48.75,68 | 49.25,68.5 49.5,68.5 53,65 R32.1 53.75,64.75 | 48.75,68 C22.2 46,71 44.75,72.25 42.5,72.25 | 52,57.75 53.75,59.5 53.75,60.25 | 52,57.75 IC1.5 | 53.75,64.75 53.75,60.25
  Bottom 0.152: 29,18.25 29,17.75 30.5,16.25 J3.1 30.75,16 38.25,8.5 38.25,5.25 39.25,4.25 ELECTRON.@36 | 29,18.25 29,21.25 v23,27.25 18.25,32 18.25,51.5 4.25,65.5 CN1.1 | 29,18.25 v23.75,18.25 | v48.75,16.75 46,14 46,8 42.25,4.25 ELECTRON.36
5V
  Top 0.152: 20,47.25 18,47.25 C11.1 | 20,47.25 22,47.25 C7.1 | 20,47.25 IC3.2 IC3.4 20,36.75 19.5,36.25 12.75,36.25 10.25,33.75 10.25,31.25 7.75,31.25 6.25,29.75 6.25,11 7,11 12.25,5.75 21.75,5.75 27.5,11.5 | 12,19.25 13.25,19.25 IC2.3 | 12,19.25 C1.2 | 12,19.25 12,11.5 27.5,11.5 | 27.5,11.5 30.75,11.5 38.25,4 38.25,2.75 58.5,2.75 59.75,4 ELECTRON.1 60,4.25 62.25,4.25 ELECTRON.@1
!RTC_INT  (via drill 0.35)
  Top 0.152: U8.3 48.25,56.25 48.75,55.75 49.5,55.75 50,56.25 v50,58.25 IC1.2 | v53,61.25 R32.2
  Bottom 0.152: v50,58.25 v53,61.25
+5V  (via drill 0.35)
  Top 0.152: RELAY1.2 68.5,15 67,13.5 D2.C | 67,32.5 68.5,34 RELAY2.2 | v64.5,33.25 65.25,32.5 67,32.5 | 67,32.5 D3.C
  Bottom 0.152: v64.5,33.25 64.5,52.75 73.75,62 73.75,75 72.75,75 69.5,71.75 69.5,71.25 57,71.25 56,72.25 27.25,72.25 25.75,70.75 CN2.5 | RELAY1.2 73,15 74.25,16.25 74.25,32.75 73,34 RELAY2.2
+12V
  Top 0.152: 9,30 7,30 TP3.P$1 7,11.5 9.75,8.75 19.75,8.75 21.25,7.25 J1.9 | 14,30 17,30 18,31 C4.1 | 12.5,30 12.5,35.5 12.75,35.75 15.25,35.75 15.5,35.5 22,35.5 23,36.5 26.75,36.5 27,36.75 R1.2 | 14,30 12.5,30 | 14,30 D8.C | 12.5,30 9,30 | 9,30 D9.A
BAT_BACKUP  (via drill 0.35)
  Top 0.152: v53,66 D5.+ | v60.5,56.75 62,55.25 BAT1.+
  Bottom 0.152: v53,66 60.5,58.5 v60.5,56.75
BUTTON1
  Top 0.152: R7.1 78,10 77.25,10.75 76,10.75 C14.2 R18.1 73,9.25 64.25,9.25 63,10.5 59,10.5 56.5,13 41.5,13 40.75,13.75 40.75,16.75 | 40.75,16.75 39.5,16.75 ELECTRON.@31 | 40.75,16.75 42,16.75 ELECTRON.31
CANA_EN
  Top 0.152: IC2.8 18.75,22 26.75,30 37.25,30 39.25,32 ELECTRON.@25 39.5,32.25 42,32.25 ELECTRON.25
CANA_RX
  Top 0.152: IC2.4 13.5,18 14.75,16.75 29.25,16.75 30,17.5 31,17.5 38.25,24.75 38.25,27 39.25,27 ELECTRON.@27 39.5,27.25 42,27.25 ELECTRON.27
CANA_TX
  Top 0.152: IC2.1 13.5,21.75 14,21.25 21.25,21.25 29.5,29.5 39.25,29.5 ELECTRON.@26 39.5,29.75 42,29.75 ELECTRON.26
COM1
  Top 0.152: CHANNEL1.2 92.75,21.75 90.75,23.75 73.75,23.75 71,21 RELAY1.1
COM2
  Top 0.152: CHANNEL2.2 92.75,40.75 90.75,42.75 73.75,42.75 71,40 RELAY2.1
GND  (via drill 0.35)  (2 unrouted)
  Top 0.152: 36.75,58.25 38,57 39,57 C19.2 | 36.75,58.25 36,59 C21.1 v34.25,61 | 47,57.25 49,59.25 IC1.3 | 47,57.25 U8.4 45.75,56.75 U8.9 | 47,57.25 C12.2 38.5,60 36.75,58.25 | STATUS.- 3.25,74 3.25,66.75 5.5,66.75 6.5,65.75 CN1.2 6.75,65.5 8.25,64 R20.1 29,63.25 35.75,63.25 | 41.25,69 40,69 C16.1 | 41.25,69 41.75,69 42,68.75 U3.1 | U3.8 43,70.75 41.75,69.5 | 41.25,69 41.75,69.5 | 43.5,69.5 U3.4 | 41.75,69.5 43.5,69.5 | 43,66 43,67.25 41.25,69 | 43,66 43,63.25 | 43,63.25 43,63 C17.1 43,63.25 | 43,66 48.75,66 C18.1 | 43,63.25 35.75,63.25 | 43.5,69.5 45.75,69.5 C22.1 | 35.75,63.25 CN2.4 | C10.2 14,39 16.75,41.75 18.5,41.75 18.75,42 18.75,46 17.25,46 17,46.25 17,48.75 18,48.75 C11.2 18,49 22,49 C7.2 22,48.75 23,48.75 | 23,48.75 23,46.5 22.75,46.25 22.5,46.25 22.5,43.25 IC3.1 22.5,43 27.5,38 27.75,38 28,37.75 28,36 23,36 19.5,32.5 | 19.5,32.5 19.25,32.75 18,32.75 C4.2 18,33 15,33 14,34 D8.A | 19.5,32.5 20,32 | 20,32 20.75,31.25 | 20.75,31.25 21,31 D7.1 20.75,31.25 | 20,32 26.25,32 27,31.25 R2.1 | J1.2 J1.1 11.5,10 11.5,18.5 8.5,18.5 8.25,18.75 8.25,20.75 C1.1 | 10.25,20.75 13.25,20.75 IC2.2 13.5,20.5 14,20 14.75,20 17.25,17.5 24.75,17.5 25,17.75 D4.3 25,18 25.5,18.5 30.5,18.5 J3.2 | 10.25,20.75 C1.1 | C1.1 | 10.25,20.75 20.75,31.25 | 23,48.75 v27,52.75 | 74.5,59 74.75,59.25 76.25,59.25 77.5,60.5 78.5,60.5 U5.27 78.75,60.75 81,60.75 U5.28 81.25,60.75 83.75,60.75 U5.29 84,60.75 86.25,60.75 U5.30 91.81,60.72 92.53,61.44 93.47,61.44 93.67,61.24 93.67,59.33 94,59 | 73.5,67.75 74.5,67.75 U5.6 | 73.5,67.75 72.25,67.75 72,68 C6.2 70.5,68.25 70.5,70.5 | 70.5,70.5 72,72 C8.2 | 70.5,70.5 69.5,71.5 62.25,71.5 BAT1.-
  Top 0.152: 74.5,59 74.25,59.25 73.75,59.25 73.5,59.5 73.5,67.75 | 74.5,59 U5.9 | U5.23 78.75,72.25 81,72.25 U5.24 81.25,72.25 83.75,72.25 U5.25 84,72.25 86.25,72.25 U5.26 | R13.1 66,43.25 Q2.2 66,43 66,36.5 63.75,34.25 63.75,28.5 68.5,28.5 68.75,28.25 68.75,27 66.75,27 R11.2 66,24.25 Q1.2 66,24 66,18.25 53,18.25 | 47.25,18.25 47.25,16.25 SDCARD.G3 47.25,16 53,16 SDCARD.G4 53,16.25 53,18.25 | 47.25,18.25 C3.2 | 53,18.25 53,19 C2.2 | 48.25,6.25 48.25,5.5 SDCARD.6 | 48,6.25 45.75,6.25 45.25,5.75 SDCARD.G2 | 48,6.25 48.25,6.25 | 56.5,6.75 56.5,5.5 SDCARD.G1 | 56.5,6.75 56.5,11.25 SDCARD.CD1 | 48.25,6.25 48.75,6.75 56.5,6.75 | 48,6.25 43.25,11 43,11 42.25,11.75 ELECTRON.33 42,12 39.5,12 ELECTRON.@33 39.25,12 38.25,12 38.25,17.5 39,18.25 47.25,18.25 | 88,3.75 86.75,3.75 86,3 POWER.- 84.5,4.25 v80.25,4.25 | 88,3.75 PPS.- | 88,3.75 91,3.75 STATUS1.- | C14.1 75,8.25 64,8.25 62.5,6.75 ELECTRON.@2 62.25,6.75 60,6.75 ELECTRON.2 59.75,6.75 56.5,6.75
  Top 0.2: C9.1 93.76,59.24 94,59
  Top 0.508: 90.14,49.88 X3.2 | 90.14,49.88 X3.5 | 90.14,49.88 90.28,49.73 X3.4 X3.3 95,55.07 95,58 94,59
  Bottom 0.152: 33.75,61.5 28.5,66.75 28.5,70.5 CN2.4 | 33.75,61.5 v34.25,61 | 33.75,61.5 27,54.75 v27,52.75 | v80.25,4.25 79.75,4.75 79.75,5 | 79.75,5 79.75,6.25 K1.4 | 79.75,5 68.75,5 67.25,6.5 62.5,6.5 ELECTRON.@2 | J3.2 30.75,18.5 37.25,12 39.25,12 ELECTRON.@33
GPS_1PPS  (via drill 0.35)
  Top 0.152: v88.75,11.5 R16.1 | v87.5,64 89.75,66.25 90.5,66.25 U5.16
  Bottom 0.152: v88.75,11.5 87.5,12.75 v87.5,64
GPS_RESET  (via drill 0.35)
  Top 0.152: v73,74.25 74.5,74.25 U5.1 | ELECTRON.12 60,32.25 62.25,32.25 ELECTRON.@12
  Bottom 0.152: v73,74.25 64,65.25 64,33.75 62.5,32.25 ELECTRON.@12
GPS_RX  (via drill 0.35)
  Top 0.152: v85.75,73.5 90,73.5 90.5,74 U5.22 | ELECTRON.3 60,9.5 62.25,9.5 ELECTRON.@3
  Bottom 0.152: v85.75,73.5 65.25,53 65.25,12.25 62.5,9.5 ELECTRON.@3
GPS_TX  (via drill 0.35)
  Top 0.152: v87.75,72.25 90,72.25 90.5,72.75 U5.21
  Bottom 0.152: v87.75,72.25 86.75,71.25 86.75,51.5 65.75,30.5 65.75,11 62.75,8 61,8 61,10.5 | 61,10.5 61,10.75 60,11.75 ELECTRON.4 | 61,10.5 62.25,11.75 ELECTRON.@4
HSPD_HI  (via drill 0.35)
  Top 0.152: 24,20.75 24,20.25 D4.2 24,20.75 | 24,20.75 TP1.P$1 | 24,20.75 18.75,20.75 IC2.7 18.5,20.5 17.5,20.5 v17,20
  Bottom 0.152: v17,20 17,10 J1.3
HSPD_LO  (via drill 0.35)
  Top 0.152: TP2.P$1 26,20.25 D4.1 25.75,20 24.75,19 v22.75,19 19,19 18.75,19.25 IC2.6
  Bottom 0.152: v22.75,19 J1.5
N$1  (via drill 0.35)
  Top 0.152: v80,8.5 80,10 R7.2
  Bottom 0.152: v80,8.5 81,7.5 81,3.5 79.75,2.25 K1.3
N$4
  Top 0.152: R12.2 68,43.25 Q2.1
N$5
  Top 0.152: D3.A R9.2 69.5,39.75 69.5,46 RELAY2.3
N$6
  Top 0.152: Q1.3 R8.1
N$7
  Top 0.152: D2.A R8.2 69.5,20.75 69.5,27 RELAY1.3
N$8
  Top 0.152: Q2.3 R9.1
N$9
  Top 0.152: PPS.+ 88.5,1.75 92.25,1.75 93,2.5 93,6.75 91.25,6.75 91,6.5 91,5.25 88,5.25 R16.2
N$10  (via drill 0.35)
  Top 0.152: v86.5,50.25 42.75,50.25 31.75,61.25 2.5,61.25 2.5,74.75 2.75,75 4,75 4.75,74.25 STATUS.+ | R17.2 v91.75,5 92.5,5 92.5,2.5 92.25,2.25 91,2.25 STATUS1.+
  Bottom 0.152: v86.5,50.25 87,49.75 87,9.75 v91.75,5
N$19
  Top 0.2: U5.10 91.19,58.81 93,57 93,52.59 X3.1
N$21
  Top 0.152: R25.1 93,68 93.75,67.25 93.75,65.25 R24.1 R6.2 92.5,63.25 83,63.25 77.75,68.5 74.75,68.5 74.5,68.75 U5.5
N$22  (via drill 0.35)
  Top 0.152: v92,62 93,62 R6.1 | v89,62 88.75,61.75 74.75,61.75 74.5,61.5 U5.7
  Bottom 0.152: v89,62 v92,62
N$23
  Top 0.152: R10.2 68,24.25 Q1.1
N$24
  Top 0.152: R21.2 28.25,69.5 28,69.5 27,70.5 27,72 34.5,72 35.75,70.75 CN2.1
N$26
  Top 0.152: R24.2 93,67 92.5,67.5 90.5,67.5 U5.17
N$27
  Top 0.152: R25.2 92.25,69 90.5,69 U5.18
N$29
  Top 0.152: POWER.+ 84,3 83.5,3.5 80,3.5 79.5,4 79.5,5 84.75,5 R19.2
N$40  (via drill 0.35)
  Top 0.152: U8.2 47.25,55.75 v47.5,55.5 | C18.2 v47.25,62 | C18.2 47.5,63 47.5,65 X4.1 | C18.2
  Bottom 0.152: v47.5,55.5 47.25,55.75 v47.25,62
N$41  (via drill 0.35)
  Top 0.152: U8.1 46,54.75 v45.75,54.75 | v45.75,62.25 45,63 C17.2 44.5,63 44.5,65 X4.2
  Bottom 0.152: v45.75,62.25 v45.75,54.75
N$43
  Top 0.152: IC3.3 17.5,43 16.25,43 12.25,39 C10.1 9,39 D9.C
N$49  (via drill 0.35)
  Top 0.152: C19.1 U8.8 45,53.75 v45.75,53.75 | D5.- 53,72.75 50,72.75 D6.- 50,72.5 v49,71.5
  Bottom 0.152: v45.75,53.75 46.5,54.5 46.5,69 v49,71.5
NC1
  Top 0.152: RELAY1.5 91,27 92.75,25.25 CHANNEL1.1
NC2
  Top 0.152: RELAY2.5 91,46 92.75,44.25 CHANNEL2.1
NO1
  Top 0.152: RELAY1.4 89.75,15 92.75,18 CHANNEL1.3
NO2
  Top 0.152: RELAY2.4 89.75,34 92.75,37 CHANNEL2.3
ONOFF
  Top 0.152: U5.4 U5.19
RELAY1
  Top 0.152: R11.1 R10.1 | R11.1 64,25.75 46,25.75 42.25,22 ELECTRON.29 42,22 39.5,22 ELECTRON.@29 | R11.1
RELAY2  (via drill 0.35)
  Top 0.152: R13.2 R12.1 | R13.2 62.75,43.5 v57.75,43.5 | R13.2 | ELECTRON.@30 39.5,19.5 42,19.5 ELECTRON.30
  Bottom 0.152: v57.75,43.5 43.25,29 43.25,20.5 42.25,19.5 ELECTRON.30
RFIDTX
  Top 0.152: ELECTRON.@28 39.5,24.5 42,24.5 ELECTRON.28 | R21.1 R20.2 27,66.75 10.25,66.75 9.25,65.75 CN1.3
  Bottom 0.152: ELECTRON.@28 39.25,24.5 34.25,24.5 34.25,23.25 31,20 29.5,20 29.5,45 9.25,65.25 9.25,65.5 CN1.3
RTC_INT  (via drill 0.35)
  Top 0.152: IC1.4 48.75,57 v48,57 | ELECTRON.5 60,14.5 62.25,14.5 ELECTRON.@5
  Bottom 0.152: v48,57 58.5,46.5 58.5,34.25 59.25,33.5 61,33.5 61,29.25 62,28.25 63.75,28.25 63.75,15.75 62.5,14.5 ELECTRON.@5
SCL  (via drill 0.35)
  Top 0.152: U8.6 41.75,56.25 39.75,58.25 | 39.75,58.25 39,59 R31.1 | v44.75,71.25 44,71.25 U3.6 | 39.75,58.25 v40.75,59.25
  Bottom 0.152: 44.25,71.25 40.75,71.25 v40.75,59.25 | 44.25,71.25 v44.75,71.25 | 44.25,71.25 44.25,58.75 40.75,55.25 40.75,28.25 37.5,28.25 30.75,21.5 J3.3
SD_CS  (via drill 0.35)
  Top 0.152: v53,4 53,5.25 SDCARD.2 | ELECTRON.@10 62.25,27.25 60,27.25 ELECTRON.10
  Bottom 0.152: v53,4 58,9 58,25.25 59.75,27 ELECTRON.10
SD_DETECT
  Top 0.152: SDCARD.CD2 56.75,15.25 58.25,16.75 59.75,16.75 ELECTRON.6 60,17 62.25,17 ELECTRON.@6
SDA  (via drill 0.35)
  Top 0.152: U8.5 v43.5,59 42,59 R33.1 | v43.5,70.25 U3.7
  Bottom 0.152: v43.5,70.25 v43.5,59 38.25,53.75 38.25,31.5 30.75,24 J3.4
SPI_MISO
  Top 0.152: SDCARD.7 47.25,5.25 47.25,4.25 44.5,4.25 43.25,5.5 43.25,10.5 39,10.5 37.75,11.75 37.75,20.75 58.75,20.75 59.75,21.75 ELECTRON.8 60,22 62.25,22 ELECTRON.@8
SPI_MOSI  (via drill 0.35)
  Top 0.152: v51.75,4 51.75,5.25 SDCARD.3
  Bottom 0.152: v51.75,4 57.5,9.75 57.5,26.5 59.25,28.25 61,28.25 61,20.75 | 61,20.75 61,20.5 60,19.5 ELECTRON.7 | 61,20.75 62.25,19.5 ELECTRON.@7
SPI_SCK  (via drill 0.35)
  Top 0.152: v55,5 55,5.5 54.25,6.25 50.25,6.25 49.5,5.5 SDCARD.5 | ELECTRON.@9 62.25,24.5 60,24.5 ELECTRON.9
  Bottom 0.152: v55,5 58.5,8.5 58.5,23.25 59.75,24.5 ELECTRON.9
STATUSLED
  Top 0.152: R17.1 90,6 90,12.25 63.75,12.25 63,13 57,13 55.75,14.25 42.25,14.25 ELECTRON.32
  Bottom 0.152: ELECTRON.@32 39.5,14.5 42,14.5 ELECTRON.32
VBAT
  Top 0.152: ELECTRON.@34 39.5,9.5 42,9.5 ELECTRON.34 | 27,33 22,33 D7.3 | 27,33 27,33.5 | 27,33.5 R1.1 | 27,33 R2.2 27,33 | ELECTRON.@11 62.25,29.75 60,29.75 ELECTRON.11 59.75,29.75 56,33.5 27,33.5
  Bottom 0.152: ELECTRON.34 42.25,9.5 45.5,12.75 45.5,15.25 59.75,29.5 ELECTRON.11

### Text on the board
Document: 3.3V | +5V | GND | TX | WINDSCREEN | 3.3V | GND | TX | RDM6300 | 125kHZ RFID / SEEED SKU / 113990041 | I2C Header | Sub-D 9 to OBD-II